# Altium schematic sheet Voeding_Soldeerbout.SchDoc: Soldeerstation
size A4; DrawnBy: Sem Kirkels; DocumentNumber: 21P001S01; Revision: V1; SheetNumber: 1; SheetTotal: 5
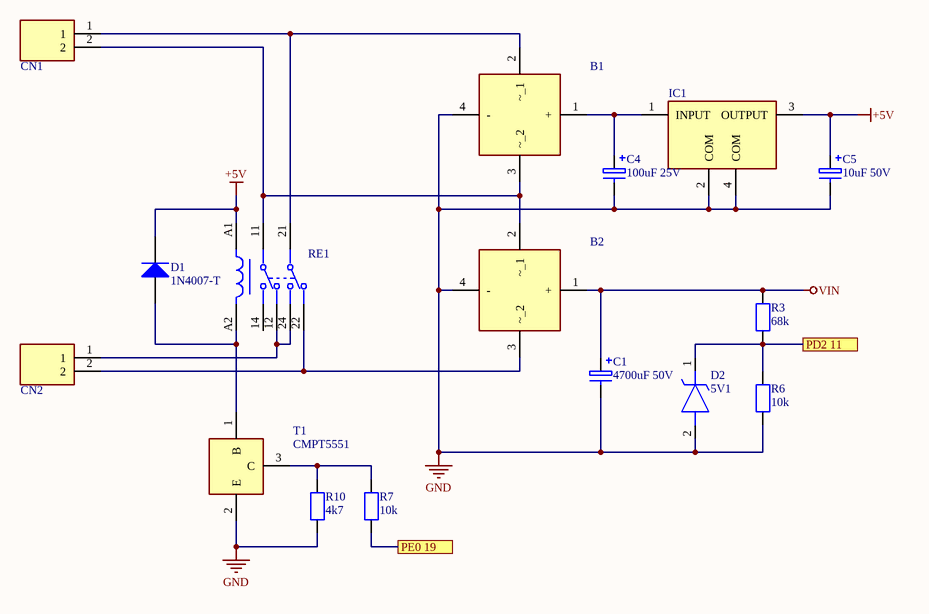
[diagram p0: Voeding_Soldeerbout.SchDoc]

## Parts
B1  GBU6J  [Bridge Rectifier]  (value not drawn)
B2  GBU6J  [Bridge Rectifier]  (value not drawn)
C1  4700uF 50V  [Elco 4700uF 50V]
C4  100uF 25V  [Elco 100uF 25V]
C5  10uF 50V  [Elco 100uF 25V]
CN1  282836-2  [2828362]  (value not drawn)
CN2  282836-2  [2828362]  (value not drawn)
D1  1N4007-T  [DIOD-DO-41-P-2_V]
D2  5V1  [DIOAD1068W53L380D172]
IC1  TL780-05CKTTR  [DC-DC Convertor]  (value not drawn)
R3  68k  [0805]
R6  10k  [0805]
R7  10k  [0805]
R10  4k7  [0805]
RE1  RT424005  [FP-RT424005-MFG]  (value not drawn)
T1  CMPT5551  [SOT95P230X109-3N]

## Ports
PD2 11, PE0 19

## Nets
+5V: C5.1 D1.2(K) IC1.3(OUTPUT) RE1.A1
GND: B1.4(-) B2.4(-) C1.2 C4.2 C5.2 D2.2(A) IC1.2(COM) IC1.4(COM) R6.1 R10.1 T1.2(E)
VIN: B2.1(+) C1.1 R3.2
PD2 11: D2.1(K) R3.1 R6.2 ; port PD2 11
PE0 19: R7.1 ; port PE0 19
NetB1_1: B1.1(+) C4.1 IC1.1(INPUT)
NetB1_2: B1.2(~_1) CN1.1 RE1.21
NetB1_3: B1.3(~_2) B2.2(~_1) CN1.2 RE1.11
NetB2_3: B2.3(~_2) CN2.2 RE1.22
NetCN2_1: CN2.1 RE1.12 RE1.24
NetD1_1: D1.1(A) RE1.A2 T1.1(B)
NetR7_2: R7.2 R10.2 T1.3(C)

Not connected (* = marked no-connect by the designer): RE1 14

## Library data of the parts
B1 B2 = GBU6J: Bridge Rectifier; Manufacturer_Name: GeneSiC Semiconductor; Datasheet Link: https://www.diodemodule.com/silicon_products/bridge_rectifiers/gbu6j.pdf; Height: 18.8mm; Manufacturer_Part_Number: GBU6J
C1 C4 C5 = Condensator Elco: Part Number: 02015A270JAT2A; Manufacturer: AVX Interconnect / Elco
CN1 CN2 = Schroefconnector 2 Pin: Connector; Manufacturer_Name: TE Connectivity; Datasheet Link: https://www.te.com/commerce/DocumentDelivery/DDEController?Action=showdoc&DocId=Customer+Drawing%7F282836%7FJ%7Fpdf%7FEnglish%7FENG_CD_282836_J.pdf%7F282836-2; Height: 10mm; Manufacturer_Part_Number: 282836-2
D1 = CMP-0639-00008-2: 1.0 A Rectifier, 8 pF, 1000 V, -65 to 150 degC, 2-Pin DO-41 Plastic, RoHS, Tape and Reel; Manufacturer: Diodes Inc; Max. Average Rectified Current IO (A): 1; CT (pF): 8; Max. IR (uA): 5; VRRM (V): 1000; Max. IFSM (A): 30; Mounting Technology: Through Hole; Packing: Tape and Reel; ComponentLink1Description: Manufacturer URL; DatasheetVersion: Rev. 8-2; PackageDescription: 2-Pin Axial Lead, Body 4.635 x 2.36 mm, Lead Spread 25.4 mm; PartNumber: 1N4007-T; ComponentLink2Description: Datasheet; RoHS: TRUE; ComponentLink1URL: http://diodes.com/; ComponentLink2URL: http://diodes.com/datasheets/ds28002.pdf; Operating Temperature Range (degC): -65 to 150; VF (V): 1; PackageReference: DO-41-P-2
D2 = 1N5231CTR: Zener Diode; Manufacturer_Name: ON Semiconductor; Datasheet Link: https://componentsearchengine.com//1N5231CTR.pdf; Mouser2 Part Number: 512-1N5231CTR; Mouser2 Price/Stock: https://www.mouser.com/Search/Refine.aspx?Keyword=512-1N5231CTR; Manufacturer_Part_Number: 1N5231CTR
IC1 = DC/DC Convertor: IC REG LIN 5V 1.5A DDPAK/TO263-3; Max Input Voltage: 25V; Number of Outputs: 1; Dropout Voltage: 2V; Polarity: Positive; Output Type: Fixed; Quiescent Current: 8mA; Min Input Voltage: 7V; Power Supply Rejection Ratio (PSRR): 85dB; Accuracy: 1%; Lead Free: Lead Free; Min Operating Temperature: 0°C; Number of Pins: 3; Max Output Voltage: 5V; Case/Package: TO-263; Number of Regulators: 1; Packaging: Tape and Reel; Max Operating Temperature: 125°C; Max Output Current: 1.5A; Nominal Output Voltage: 5V; Height: 4.83mm; Mount: Surface Mount; Weight: 0.050897oz; Output Current: 1.5A; Width: 9.65mm; Output Voltage: 5V; Length: 10.67mm; REACH SVHC: No SVHC; Output Voltage Accuracy: 1%; Package Quantity: 1
R3 R6 R7 R10 = Resistor 0805: Manufacturer: Vishay Dale; Part Number: CRCW08050000Z0EA
RE1 = CMP-03395-000087-1: RELAY GENERAL PURPOSE DPDT 8A 5V; Manufacturer: TE Connectivity; Coil Power: 403mW; Number Of Contacts: 2; Coil Resistance: 62Ω; Coil Type: Non-Latching; Manufacturer Part Number: RT424005; Category: Relay; Octopart: https://octopart.com/5-1393243-9-te+connectivity-41835766; Device Class L3: Power Relays; ComponentLink2URL: https://www.te.com/commerce/DocumentDelivery/DDEController?Action=showdoc&DocId=Data+Sheet%7FRT2%7F1014%7Fpdf%7FEnglish%7FENG_DS_RT2_1014.pdf%7F5-1393243-9; Ambient Temperature Range High: +85°C; ComponentLink2Description: Datasheet; Throw Configuration: DPDT; Digikey Description: RELAY GENERAL PURPOSE DPDT 8A 5V; Package: RT424005; Automotive: No; Device Class L1: Electromechanical; Height: 15.7mm; Device Class L2: Relays; Ambient Temperature Range Low: -40°C; Coil Voltage: 5V; Current Rating: 8A; Mouser Description: General Purpose Relay, Rt2 Series, Power, Non Latching, Dpdt, 5 Vdc, 8 A Rohs Compliant: Yes; Lead Free: Yes; RoHS: TRUE
T1 = CMPT5551: Transistor; Manufacturer_Name: Central Semiconductor; Manufacturer_Part_Number: CMPT5551 TR PBFREE; Datasheet Link: https://my.centralsemi.com/datasheets/CMPT5551.PDF; Height: 1.09mm